# Altium project Dashboard.PrjPcb
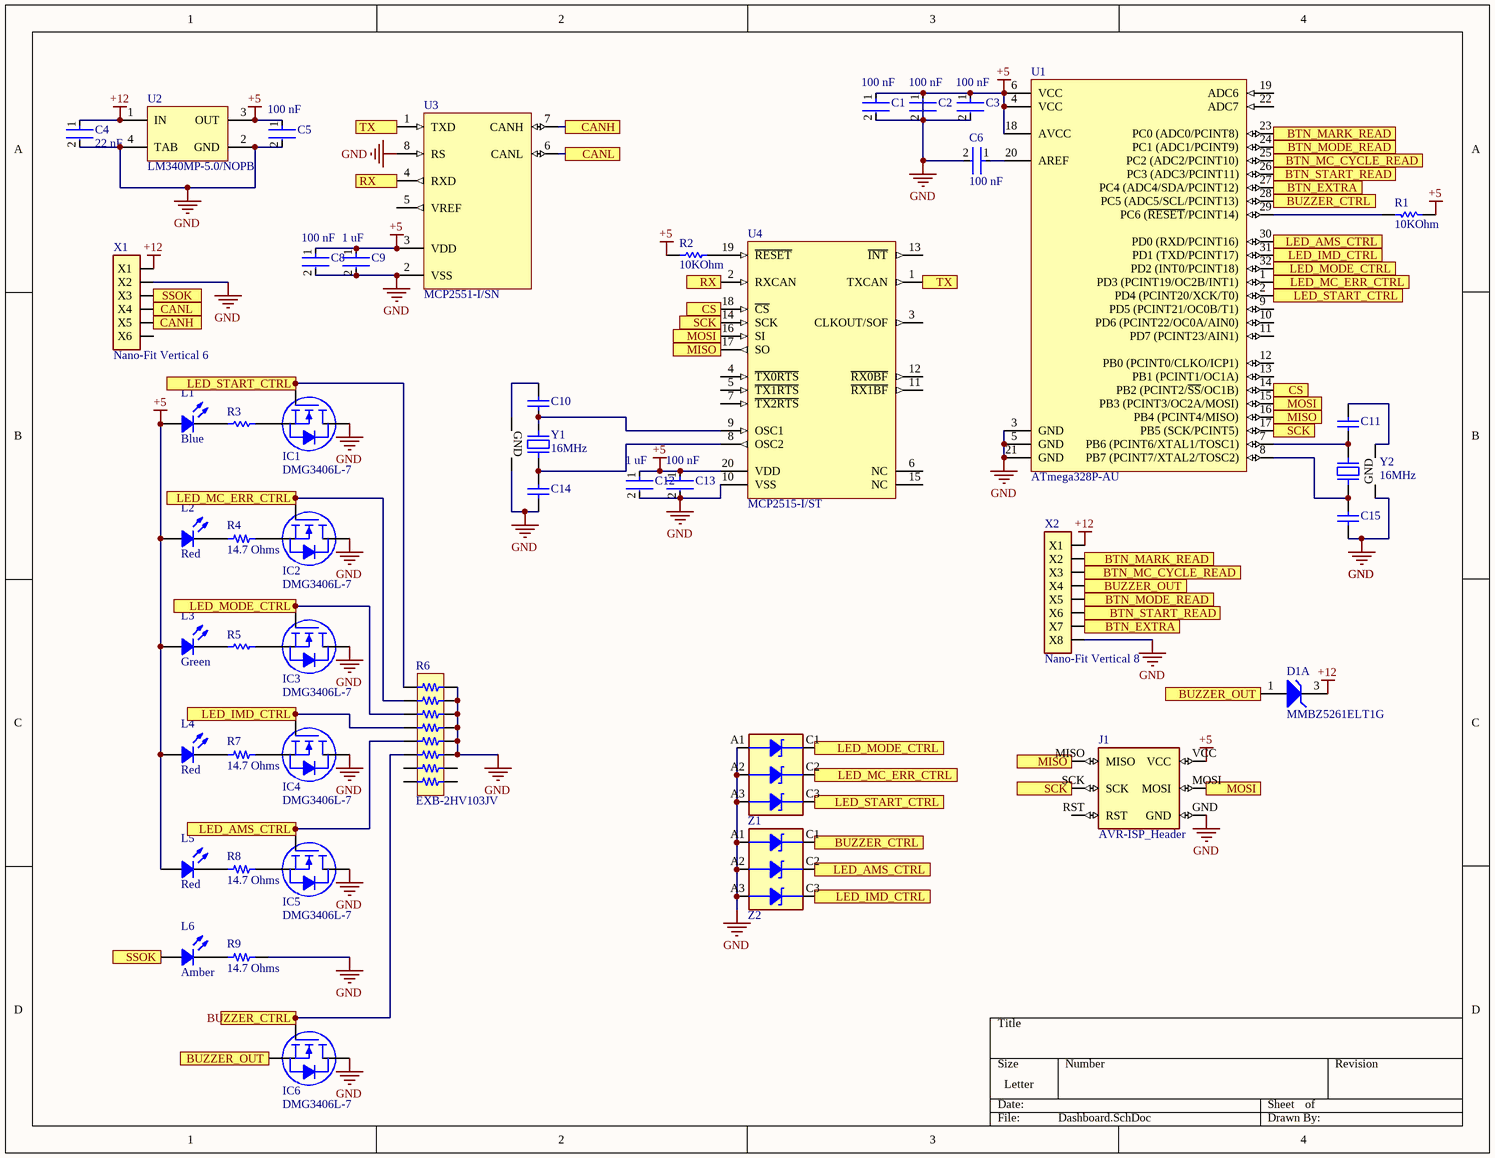
[diagram p0: Dashboard.SchDoc]
1 sheet, 47 parts. Net scope: flat (ports and power ports of the same name join across sheets).
Board file: Dashboard.PcbDoc

## Sheet Dashboard.SchDoc
size Letter

### Parts
C1  value 100 nF  [FP-CC0603-DA-MFG]  (hidden comment: CC0603KRX7R7BB104)
C2  value 100 nF  [FP-CC0603-DA-MFG]  (hidden comment: CC0603KRX7R7BB104)
C3  value 100 nF  [FP-CC0603-DA-MFG]  (hidden comment: CC0603KRX7R7BB104)
C4  Capacitance: 22 nF  [FP-CC0603-DA-MFG]  (hidden comment: CC0603KRX7R8BB223)
C5  value 100 nF  [FP-CC0603-DA-MFG]  (hidden comment: CC0603KRX7R7BB104)
C6  value 100 nF  [FP-CC0603-DA-MFG]  (hidden comment: CC0603KRX7R7BB104)
C8  value 100 nF  [FP-CC0603-DA-MFG]  (hidden comment: CC0603KRX7R7BB104)
C9  value 1 uF  [FP-CC0603-DA-MFG]  (hidden comment: CC0603KRX7R7BB105)
C10  06032U150GAT2A  [CAPC1508X91X25LL25T13]  (value not drawn)
C11  06032U150GAT2A  [CAPC1508X91X25LL25T13]  (value not drawn)
C12  value 1 uF  [FP-CC0603-DA-MFG]  (hidden comment: CC0603KRX7R7BB105)
C13  value 100 nF  [FP-CC0603-DA-MFG]  (hidden comment: CC0603KRX7R7BB104)
C14  06032U150GAT2A  [CAPC1508X91X25LL25T13]  (value not drawn)
C15  06032U150GAT2A  [CAPC1508X91X25LL25T13]  (value not drawn)
D1  MMBZ5261ELT1G  [ONSC-SOT-23-3-318-08_V]  (part A of 2)
IC1  DMG3406L-7  [DIODES SOT-23-3]
IC2  DMG3406L-7  [DIODES SOT-23-3]
IC3  DMG3406L-7  [DIODES SOT-23-3]
IC4  DMG3406L-7  [DIODES SOT-23-3]
IC5  DMG3406L-7  [DIODES SOT-23-3]
IC6  DMG3406L-7  [DIODES SOT-23-3]
J1  AVR-ISP_Header  [AVR-ISP Header]
L1  Blue  [Cree XLamp]
L2  Red  [Cree XLamp]
L3  Green  [Cree XLamp]
L4  Red  [Cree XLamp]
L5  Red  [Cree XLamp]
L6  Amber  [Cree XLamp]
R1  Resistance: 10KOhm  [RESC1608X55X25ML10T15]  (hidden comment: RC0603FR-0710KL)
R2  Resistance: 10KOhm  [RESC1608X55X25ML10T15]  (hidden comment: RC0603FR-0710KL)
R3  CRCW060310R0FKEA  [RESC1609X50X30ML10T20]  (value not drawn)
R4  14.7 Ohms  [RES 0603_1608]
R5  CRCW060310R0FKEA  [RESC1609X50X30ML10T20]  (value not drawn)
R6  EXB-2HV103JV  [RESNET 1506-16 CONVEX]
R7  14.7 Ohms  [RES 0603_1608]
R8  14.7 Ohms  [RES 0603_1608]
R9  14.7 Ohms  [RES 0603_1608]
U1  ATmega328P-AU  [32A_M]
U2  LM340MP-5.0/NOPB  [DCY0004A_L]
U3  MCP2551-I/SN  [SOIC-SN8_N]
U4  MCP2515-I/ST  [TSSOP-ST20_N]
X1  Nano-Fit Vertical 6  [Nano-Fit Vertical 6]
X2  Nano-Fit Vertical 8  [NANO-FIT VERTICAL 8]
Y1  16MHz  [NDK NX3225SA]
Y2  16MHz  [NDK NX3225SA]
Z1  MMBZ5245BTS-7-F  [SOT-363]  (value not drawn)
Z2  MMBZ5245BTS-7-F  [SOT-363]  (value not drawn)

### Ports
BTN_EXTRA, BTN_MARK_READ, BTN_MC_CYCLE_READ, BTN_MODE_READ, BTN_START_READ, BUZZER_CTRL, BUZZER_OUT, CANH, CANL, CS, LED_AMS_CTRL, LED_IMD_CTRL, LED_MC_ERR_CTRL, LED_MODE_CTRL, LED_START_CTRL, MISO, MOSI, RX, SCK, SSOK, TX

### Nets
+5: C1.1 C2.1 C3.1 C5.1 C8.1 C9.1 C12.1 C13.1 J1.VCC L1.1 L2.1 L3.1 L4.1 L5.1 R1.1 R2.1 U1.4(VCC) U1.6(VCC) U1.18(AVCC) U2.3(OUT) U3.3(VDD) U4.20(VDD)
+12: C4.1 D1.3(K) U2.1(IN) X1.1(X1) X2.1(X1)
GND: C1.2 C2.2 C3.2 C4.2 C5.2 C6.2 C8.2 C9.2 C12.2 C13.2 C14.1 C15.1 IC1.3(D) IC2.3(D) IC3.3(D) IC4.3(D) IC5.3(D) IC6.3(D) J1.GND R6.11 R6.12 R6.13 R6.14 R6.15 R6.16 R9.2 U1.3(GND) U1.5(GND) U1.21(GND) U2.2(GND) U2.4(TAB) U3.2(VSS) U3.8(RS) U4.10(VSS) X1.2(X2) X2.8(X8) Y1.2(GND) Y2.4(GND) Z1.A1 Z1.A2 Z1.A3 Z2.A1 Z2.A2 Z2.A3
NetC6_1: C6.1 U1.20(AREF)
NetC10_1: C10.1 U4.9(OSC1) Y1.1
NetC10_2: C10.2 Y1.4(GND)
NetC11_1: C11.1 Y2.2(GND)
NetC11_2: C11.2 U1.7(PB6_(PCINT6/XTAL1/TOSC1)) Y2.3
NetC14_2: C14.2 U4.8(OSC2) Y1.3
NetC15_2: C15.2 U1.8(PB7_(PCINT7/XTAL2/TOSC2)) Y2.1
NetD1_1: D1.1(A) IC6.2(S) X2.4(X4) ; port BUZZER_OUT
NetIC1_1: IC1.1(G) R6.1 U1.2(PD4_(PCINT20/XCK/T0)) Z1.C3 ; port LED_START_CTRL
NetIC1_2: IC1.2(S) R3.2
NetIC2_1: IC2.1(G) R6.2 U1.1(PD3_(PCINT19/OC2B/INT1)) Z1.C2 ; port LED_MC_ERR_CTRL
NetIC2_2: IC2.2(S) R4.2
NetIC3_1: IC3.1(G) R6.3 U1.32(PD2_(INT0/PCINT18)) Z1.C1 ; port LED_MODE_CTRL
NetIC3_2: IC3.2(S) R5.2
NetIC4_1: IC4.1(G) R6.4 U1.31(PD1_(TXD/PCINT17)) Z2.C3 ; port LED_IMD_CTRL
NetIC4_2: IC4.2(S) R7.2
NetIC5_1: IC5.1(G) R6.5 U1.30(PD0_(RXD/PCINT16)) Z2.C2 ; port LED_AMS_CTRL
NetIC5_2: IC5.2(S) R8.2
NetIC6_1: IC6.1(G) R6.6 U1.28(PC5_(ADC5/SCL/PCINT13)) Z2.C1 ; port BUZZER_CTRL
NetJ1_MISO: J1.MISO U1.16(PB4_(PCINT4/MISO)) U4.17(SO) ; port MISO
NetJ1_MOSI: J1.MOSI U1.15(PB3_(PCINT3/OC2A/MOSI)) U4.16(SI) ; port MOSI
NetJ1_SCK: J1.SCK U1.17(PB5_(SCK/PCINT5)) U4.14(SCK) ; port SCK
NetL1_2: L1.2 R3.1
NetL2_2: L2.2 R4.1
NetL3_2: L3.2 R5.1
NetL4_2: L4.2 R7.1
NetL5_2: L5.2 R8.1
NetL6_1: L6.1 X1.3(X3) ; port SSOK
NetL6_2: L6.2 R9.1
NetR1_2: R1.2 U1.29(PC6_(~{RESET}/PCINT14))
NetR2_2: R2.2 U4.19(~{RESET})
NetU1_14: U1.14(PB2_(PCINT2/~{SS}/OC1B)) U4.18(~{CS}) ; port CS
NetU1_23: U1.23(PC0_(ADC0/PCINT8)) X2.2(X2) ; port BTN_MARK_READ
NetU1_24: U1.24(PC1_(ADC1/PCINT9)) X2.5(X5) ; port BTN_MODE_READ
NetU1_25: U1.25(PC2_(ADC2/PCINT10)) X2.3(X3) ; port BTN_MC_CYCLE_READ
NetU1_26: U1.26(PC3_(ADC3/PCINT11)) X2.6(X6) ; port BTN_START_READ
NetU1_27: U1.27(PC4_(ADC4/SDA/PCINT12)) X2.7(X7) ; port BTN_EXTRA
NetU3_1: U3.1(TXD) U4.1(TXCAN) ; port TX
NetU3_4: U3.4(RXD) U4.2(RXCAN) ; port RX
NetU3_6: U3.6(CANL) X1.4(X4) ; port CANL
NetU3_7: U3.7(CANH) X1.5(X5) ; port CANH

Not connected (* = marked no-connect by the designer): J1 RST; R6 7 8 9 10; U1 9(PD5_(PCINT21/OC0B/T1)) 10(PD6_(PCINT22/OC0A/AIN0)) 11(PD7_(PCINT23/AIN1)) 12(PB0_(PCINT0/CLKO/ICP1)) 13(PB1_(PCINT1/OC1A)) 19(ADC6) 22(ADC7); U3 5(VREF); U4 3(CLKOUT/SOF) 4(~{TX0RTS}) 5(~{TX1RTS}) 6(NC) 7(~{TX2RTS}) 11(~{RX1BF}) 12(~{RX0BF}) 13(~{INT}) 15(NC); X1 6(X6)

### Library data of the parts
C1-C3 C5 C6 C8 C13 = CMP-03422-000030-1: CAP CER 0.1UF 16V X7R 0603; Manufacturer: YAGEO; Tolerance: 0.1; Temperature Coefficient: 15%; Material: Ceramic; Voltage Rating: 16 V; Package: CC0603-DA; ComponentLink2Description: Datasheet; Octopart: https://octopart.com/cc0603krx7r7bb104-yageo-192941; Temperature Range High: +125°C; Digikey Description: CAP CER 0.1UF 16V X7R 0603; Voltage: 16 V; Device Class L2: Capacitors; Height: 0.9mm; Temperature: -55°C to +125°C; Manufacturer Part Number: CC0603KRX7R7BB104; Device Class L1: Passive Components; Device Class L3: Ceramic Capacitors; ComponentLink2URL: http://www.yageo.com/documents/recent/UPY-GPHC_X7R_6.3V-to-50V_18.pdf; Footprint Url: http://www.yageo.com/exep/pages/download/literatures/UPY-C_GEN_24.pdf; RoHS: TRUE; Temperature Range Low: -55°C; Temperature Characteristic: X7R; Lead Free: Yes; Capacitance: 100 nF; Category: Cap; Mouser Description: Multilayer Ceramic Capacitor, CC Series, 0.1 - F, - 10%, X7R, 16 V, 0603 [1608 Metric]; Automotive: No
C4 = CMP-03422-001178-1: CAP CER 0.022UF 25V X7R 0603; Manufacturer: YAGEO; Material: Ceramic; Temperature Coefficient: 15%; Value: 22 nF; Tolerance: 0.1; Temperature Range High: +125°C; Temperature: -55°C to +125°C; Mouser Description: Multilayer Ceramic Capacitors MLCC - SMD/SMT 22nF 25V X7R 10%; Voltage: 25 V; Height: 0.9mm; Temperature Characteristic: X7R; ComponentLink2Description: Datasheet; Digikey Description: CAP CER 0.022UF 25V X7R 0603; Category: Cap; Temperature Range Low: -55°C; Lead Free: Yes; RoHS: TRUE; Voltage Rating: 25 V; Package: CC0603-DA; Footprint Url: http://www.yageo.com/exep/pages/download/literatures/UPY-C_GEN_24.pdf; Device Class L1: Passive Components; Device Class L2: Capacitors; Octopart: https://octopart.com/cc0603krx7r8bb223-yageo-39467728; Manufacturer Part Number: CC0603KRX7R8BB223; Device Class L3: Ceramic Capacitors; Automotive: No; ComponentLink2URL: http://www.yageo.com/documents/recent/UPY-GPHC_X7R_6.3V-to-50V_18.pdf
C9 C12 = CMP-03422-000924-1: CAP CER 1UF 16V X7R 0603; Manufacturer: YAGEO; Tolerance: 0.1; Temperature Coefficient: 15%; Material: Ceramic; Package: CC0603-DA; RoHS: TRUE; Device Class L2: Capacitors; Temperature Characteristic: X7R; Temperature: -55°C to +125°C; Temperature Range Low: -55°C; Automotive: No; ComponentLink2Description: Datasheet; Lead Free: Yes; Capacitance: 1 uF; ComponentLink2URL: http://www.yageo.com/documents/recent/UPY-GPHC_X7R_6.3V-to-50V_18.pdf; Device Class L1: Passive Components; Voltage: 16 V; Octopart: https://octopart.com/cc0603krx7r7bb105-yageo-42271928; Category: Cap; Digikey Description: CAP CER 1UF 16V X7R 0603; Footprint Url: http://www.yageo.com/exep/pages/download/literatures/UPY-C_GEN_24.pdf; Height: 0.9mm; Manufacturer Part Number: CC0603KRX7R7BB105; Voltage Rating: 16 V; Temperature Range High: +125°C; Mouser Description: Multilayer Ceramic Capacitor, CC Series, 1 - F, - 10%, X7R, 16 V, 0603 [1608 Metric]; Device Class L3: Ceramic Capacitors
C10 C11 C14 C15 = CMP-2006-04659-1: Manufacturer: AVX Interconnect / Elco; Part Number: 06032U150GAT2A
D1 = CMP-1060-01202-1: Zener Voltage Regulator, 225 mW, 3-Pin SOT-23, Pb-Free, Tape and Reel; Manufacturer: On Semiconductor; VZ Typ (V): 47; ComponentLink3URL: http://www.onsemi.cn/pub_link/Collateral/318-08.PDF; ComponentLink3Description: Package Specification; ComponentLink1Description: Manufacturer URL; PackageReference: SOT-23-3-318-08; ComponentLink2Description: Datasheet; ComponentLink1URL: http://www.onsemi.com/; PackageDescription: 3-Pin Small Outline Transistor, Body 2.92 x 1.3 mm, Pitch 0.95 mm; Packing: Tape and Reel; RoHS: Pb-Free; PackageVersion: Rev. AP, 11/2009; ComponentLink2URL: http://www.onsemi.cn/pub_link/Collateral/MMBZ5221ELT1-D.PDF; DatasheetVersion: Rev. 7; PartNumber: MMBZ5261ELT1G; Mounting Technology: Surface Mount
IC1-IC6 = DMG3406L-7: MOSFET N-CH 30V 3.6A SOT23; Manufacturer: Diodes Incorporated; Current - Continuous Drain (Id) @ 25°C: 3.6A (Ta); Drive Voltage (Max Rds On,  Min Rds On): 4.5V, 10V; FET Type: N-Channel; Gate Charge (Qg) (Max) @ Vgs: 11.2nC @ 10V; Input Capacitance (Ciss) (Max) @ Vds: 495pF @ 15V; Power Dissipation (Max): 770mW (Ta); Rds On (Max) @ Id, Vgs: 50mOhm @ 3.6A, 10V; Vgs (Max): ±20V; Vgs(th) (Max) @ Id: 2V @ 250µA; Part Number: DMG3406L-7; ComponentLink1Description: Datasheet; ComponentLink1URL: https://www.diodes.com/assets/Datasheets/DMG3406L.pdf; ComponentLink2Description: DigiKey Link; ComponentLink2URL: http://digikey.com/product-detail/en/diodes-incorporated/DMG3406L-7/DMG3406L-7DICT-ND/5223238; Device Package: TO-236-3, SC-59, SOT-23-3; Drain to Source Voltage (Vdss): 30V; LastUpdated: 1/21/2020 4:00:19 AM; Lifecycle Status: Active; Minimum Order: 1; Mounting Type: Surface Mount; Operating Temperature: -55°C ~ 150°C (TJ); Package / Case: TO-236-3, SC-59, SOT-23-3; Packaging: TapeAndReel; Part Status: Active; Price: 0.08; Series: -; Supplier 1: DigiKey; Supplier Part Number 1: DMG3406L-7DICT-ND; Supplier Device Package: SOT-23; Technology: MOSFET (Metal Oxide)
L1 = LED - Blue Xlamp: Blue LED Cree XLamp XP-E2 / XPEBBL-L1-0000-00Y01; pin to pad: 1>V+ 2>V-; Supplier 1: Digi-Key; Supplier 2: Digi-Key; Supplier 3: Mouser; Supplier 4: Avnet; Supplier 5: Digi-Key; Supplier 6: RSComponents; Supplier 7: RSComponents; Supplier 8: RSComponents; Supplier 9: Arrow; Supplier 10: Digi-Key; Supplier Part Number 9: XPEBBL-L1-0000-00Y01; Supplier Part Number 8: 1629932; Supplier Part Number 10: XPEBBL-L1-0000-00Y01-ND; Supplier Part Number 7: 9076677P; Supplier Part Number 6: 9076677; Supplier Part Number 4: XPEBBL-L1-0000-00Y01; Supplier Part Number 3: 941-XPEBBLL10000Y01; Supplier Part Number 5: XPEBBL-L1-0000-00Y01TR-ND; Supplier Part Number 2: XPEBBL-L1-0000-00Y01DKR-ND; Supplier Part Number 1: XPEBBL-L1-0000-00Y01CT-ND
L2 L4 L5 = LED - Red XLlamp: Red LED Cree XLamp XP-E2 / XPEBRD-L1-R250-00502; pin to pad: 1>V+ 2>V-; Supplier 1: Mouser; Supplier 2: Avnet; Supplier 3: Digi-Key; Supplier 4: Arrow; Supplier Part Number 2: XPEBRD-L1-R250-00502; Supplier Part Number 1: 941-XPEBRDL1R250502; Supplier Part Number 3: XPEBRD-L1-R250-00502-ND; Supplier Part Number 4: XPEBRD-L1-R250-00502
L3 = LED - Green Xlamp: Green LED Cree XLamp XP-E2 / XPEBGR-L1-0000-00A01; pin to pad: 1>V+ 2>V-; Supplier 1: Digi-Key; Supplier 2: Digi-Key; Supplier 3: Digi-Key; Supplier 4: Arrow; Supplier 5: Newark; Supplier 6: Mouser; Supplier 7: Newark; Supplier 8: Avnet; Supplier 9: Farnell; Supplier 10: Farnell; Supplier 11: Digi-Key; Supplier Part Number 11: XPEBGR-L1-0000-00A01-ND; Supplier Part Number 10: 2839922RL; Supplier Part Number 9: 2839922; Supplier Part Number 7: 95W0598; Supplier Part Number 3: XPEBGR-L1-0000-00A01TR-ND; Supplier Part Number 6: 941-XPEBGRL10000A01; Supplier Part Number 8: XPEBGR-L1-0000-00A01; Supplier Part Number 5: 49AC0942; Supplier Part Number 4: XPEBGR-L1-0000-00A01; Supplier Part Number 2: XPEBGR-L1-0000-00A01DKR-ND; Supplier Part Number 1: XPEBGR-L1-0000-00A01CT-ND
L6 = LED - Amber Xlamp: Amber LED Cree XLamp XP-E2 / XPEBAM-L1-0000-00601; pin to pad: 1>V+ 2>V-; Supplier 1: Digi-Key; Supplier 2: Digi-Key; Supplier 3: Arrow; Supplier 4: Newark; Supplier 5: Newark; Supplier 6: Avnet; Supplier 7: Mouser; Supplier 8: Digi-Key; Supplier 9: Farnell; Supplier 10: Farnell; Supplier 11: Digi-Key; Supplier Part Number 1: XPEBAM-L1-0000-00601CT-ND; Supplier Part Number 2: XPEBAM-L1-0000-00601DKR-ND; Supplier Part Number 4: 49AC0940; Supplier Part Number 3: XPEBAM-L1-0000-00601; Supplier Part Number 5: 95W0551; Supplier Part Number 6: XPEBAM-L1-0000-00601; Supplier Part Number 7: 941-XPEBAML10000601; Supplier Part Number 8: XPEBAM-L1-0000-00601TR-ND; Supplier Part Number 9: 2839920; Supplier Part Number 10: 2839920RL; Supplier Part Number 11: XPEBAM-L1-0000-00601-ND
R1 R2 = CMP-2100-03664-1: Chip Resistor, 10 KOhm, +/- 1%, 01 W, -55 to 155 degC, 0603 (1608 Metric), RoHS, Tape and Reel; Manufacturer: Yageo; Temperature Coefficient: 100ppm/degreesC; Voltage Rating: 75V; Power Rating: 100mW; Voltage Rating (DC): 50V; Composition: ThickFilm; RoHSCompliant: true; Height: 0.45mm; Lead Free: LeadFree; Case Code (Metric): 1608; Case/Package: 0603; Datasheet Version: Rev. 5, 10/2016; Package Reference: 0603; Depth: 0.8mm; Package Description: 2-Pin Surface Mount Device, Body 1.6 x 0.8 mm; Case Code (Imperial): 0603; Packaging: TapeandReel; Termination: SMD/SMT; Lead Pitch: 0.3mm; Width: 0.8mm; Number of Pins: 2; Length: 1.6mm; REACH SVHC: NoSVHC; Military Standard: Not; Max Operating Temperature: 155degC; Min Operating Temperature: -55degC; Manufacturer URL: http://www.yageo.com/; Datasheet URL: http://www.yageo.com/NewPortal/yageodocoutput?fileName=/pdf/R-Chip/PYu-RC_Group_51_RoHS_L_5.pdf; Weight: 7.1E-05oz; Tolerance: 1%
R3 R5 = CMP-2000-03845-1: Manufacturer: Vishay Dale; Part Number: CRCW060310R0FKEA
R4 R7-R9 = ERJ-3EKF14R7V: RES SMD 14.7 OHM 1% 1/10W 0603; Manufacturer: Panasonic Electronic Components; Power (Watts): 0.1W, 1/10W; Temperature Coefficient: ±100ppm/°C; Part Number: ERJ-3EKF14R7V; Value: 14.7 Ohms; ComponentLink1Description: Datasheet; ComponentLink1URL: https://industrial.panasonic.com/cdbs/www-data/pdf/RDA0000/AOA0000C304.pdf; ComponentLink2Description: DigiKey Link; ComponentLink2URL: http://digikey.com/product-detail/en/panasonic-electronic-components/ERJ-3EKF14R7V/P14.7HCT-ND/198163; Composition: Thick Film; Device Package: 0603 (1608 Metric); Features: Automotive AEC-Q200; Height - Seated (Max): 0.022" (0.55mm); LastUpdated: 1/21/2020 12:14:34 AM; Lifecycle Status: Active; Minimum Order: 1; Number of Terminations: 2; Operating Temperature: -55°C ~ 155°C; Package / Case: 0603 (1608 Metric); Packaging: TapeAndReel; PartId: 26262; Part Status: Active; Price: 0.01; Ratings: AEC-Q200; Resistance: 14.7 Ohms; Series: ERJ; Size / Dimension: 0.063" L x 0.031" W (1.60mm x 0.80mm); Supplier 1: DigiKey; Supplier Part Number 1: P14.7HCT-ND; Supplier Device Package: 0603; Tolerance: ±1%
R6 = EXB-2HV103JV: RES ARRAY 8 RES 10K OHM 1506; Manufacturer: Panasonic Electronic Components; Circuit Type: Isolated; Number of Resistors: 8; Power Per Element: 62.5mW; Temperature Coefficient: ±200ppm/°C; Tolerance: ±5%; Part Number: EXB-2HV103JV; Applications: Automotive AEC-Q200; ComponentLink1Description: Datasheet; ComponentLink1URL: https://industrial.panasonic.com/cdbs/www-data/pdf/AOC0000/AOC0000C14.pdf; ComponentLink2Description: DigiKey Link; ComponentLink2URL: http://digikey.com/product-detail/en/panasonic-electronic-components/EXB-2HV103JV/Y1103CT-ND/285393; Device Package: 1506, Convex, Long Side Terminals; Height - Seated (Max): 0.022" (0.55mm); LastUpdated: 1/21/2020 3:39:13 AM; Lifecycle Status: Active; Minimum Order: 1; Mounting Type: Surface Mount; Number of Pins: 16; Operating Temperature: -55°C ~ 125°C; Package / Case: 1506, Convex, Long Side Terminals; Packaging: TapeAndReel; PartId: 657; Part Status: Active; Price: 0.03; Resistance (Ohms): 10k; Series: EXB; Size / Dimension: 0.150" L x 0.063" W (3.80mm x 1.60mm); Supplier 1: DigiKey; Supplier Part Number 1: Y1103CT-ND; Supplier Device Package: 1506
U1 = CMP-0095-00269-2: 8-bit AVR Microcontroller, 32KB Flash, 1KB EEPROM, 2KB SRAM, 32-pin TQFP, Industrial Grade (-40°C to 85°C); PackageDescription: 32-Lead, 7x7x1.0 mm Body, 0.8mm Lead Pitch, Thin Profile Plastic Quad Flat Package (TQFP); DatasheetVersion: revD, May-2011; RevisionNote: DatasheetVersion & PackageVersion updated. URLs added.; ComponentLink1URL: http://www.atmel.com/; ComponentLink2Description: ATmega48A/48PA/88A/88PA/168A/168PA/328/328P Datasheet; Code_JEDEC: MS-026-ABA; ComponentLink1Description: Manufacturer URL; PackageReference: 32A; ComponentLink3Description: ATmega48A/48PA/88A/88PA/168A/168PA/328/328P Summary; ComponentLink2URL: http://www.atmel.com/dyn/resources/prod_documents/doc8271.pdf; PackageVersion: revC, Oct-2010; ComponentLink3URL: http://www.atmel.com/dyn/resources/prod_documents/8271S.pdf
U2 = CMP-0062-01784-3: Series 3-Terminal Positive Regulators, 4-pin SOT-223, Pb-Free; Manufacturer: Texas Instruments; PowerWise: N; CompType: LDO IC; PackageTopMarking: XYTT*N00A; Code_IPC: SOT223-4; PackageReference: DCY0004A; ComponentLink1Description: Datasheet URL; PackageDescription: Molded SOT-223, 6.50 x 3.56 x 1.6mm Body, 4 Lead, 2.3mm Pitch; PinCount: 4; RoHS: Y; ComponentLink1URL: http://www.ti.com/general/docs/lit/getliterature.tsp?genericPartNumber=LM340-N&fileType=pdf; Code_JEDEC: TO-261-AA
U3 = CMP-0186-00138-2: High-Speed CAN Transceiver, 8-Pin SOIC, Industrial Temperature; Code_JEDEC: MS-012; ComponentLink3URL: http://www.microchip.com/stellent/groups/techpub_sg/documents/packagingspec/en012702.pdf; DatasheetVersion: revF, Jul-2010; PackageVersion: revBB, Aug-2009; PackageDescription: 8-Lead Plastic Small Outline (SN) - Narrow, 3.90mm Body [SOIC]; ComponentLink1URL: http://www.microchip.com/; ComponentLink3Description: Package Specification; ComponentLink2Description: Datasheet; Code_IPC: SOIC127P600-8; ComponentLink1Description: Manufacturer URL; PackageReference: SOIC-SN8; ComponentLink2URL: http://ww1.microchip.com/downloads/en/DeviceDoc/21667F.pdf; RevisionNote: URLs added. DatasheetVersion updated.
U4 = CMP-0186-00077-2: Stand-Alone CAN Controller With SPI Interface, 20-Pin TSSOP, Industrial Temperature; DatasheetVersion: revF, Oct-2010; ComponentLink1Description: Manufacturer URL; PackageDescription: 20-Lead Plastic Thin Shrink Small Outline (ST) - 4.4mm Body [TSSOP]; ComponentLink1URL: http://www.microchip.com/; RevisionNote: URLs added. DatasheetVersion updated.; PackageReference: TSSOP-ST20; Code_JEDEC: MO-153-AC; ComponentLink2Description: Datasheet; ComponentLink2URL: http://ww1.microchip.com/downloads/en/DeviceDoc/21801f.pdf; PackageVersion: revBB, Aug-2009; ComponentLink3URL: http://www.microchip.com/stellent/groups/techpub_sg/documents/packagingspec/en012702.pdf; ComponentLink3Description: Package Specification
Y1 Y2 = NX3225SA-16.000000MHZ-T1: CRYSTAL 16.0000MHZ 10PF SMD; Manufacturer: NDK America, Inc.; ESR (Equivalent Series Resistance): 60 Ohms; Frequency Stability: ±10ppm; Operating Mode: Fundamental; Part Number: NX3225SA-16.000000MHZ-T1; ComponentLink1Description: Datasheet; ComponentLink1URL: //media.digikey.com/pdf/Data Sheets/NDK PDFs/NX3225SA-16.000000MHz-T1.pdf; ComponentLink2Description: DigiKey Link; ComponentLink2URL: http://digikey.com/product-detail/en/ndk-america-inc/NX3225SA-16.000000MHZ-T1/644-1100-1-ND/1468361; Device Package: 4-SMD, No Lead; Frequency: 16MHz; Frequency Tolerance: ±10ppm; Height - Seated (Max): 0.028" (0.70mm); LastUpdated: 1/21/2020 3:23:16 AM; Lifecycle Status: Active; Load Capacitance: 10pF; Minimum Order: 1; Mounting Type: Surface Mount; Operating Temperature: -20°C ~ 70°C; Package / Case: 4-SMD, No Lead; Packaging: TapeAndReel; PartId: 592; Part Status: Active; Price: 0.47; Series: NX3225SA; Size / Dimension: 0.126" L x 0.098" W (3.20mm x 2.50mm); Supplier 1: DigiKey; Supplier Part Number 1: 644-1100-1-ND; Type: MHz Crystal; Value: 16MHz
Z1 Z2 = MMBZ5245BTS-7-F: Three independent zener diodes in an array; pin to pad: A1>1 A2>2 A3>3 C1>6 C2>5 C3>4; ComponentLink1Description: New link; ComponentLink1URL: *; Supplier 1: Digi-Key; Supplier 2: Digi-Key; Supplier 3: Digi-Key; Supplier 4: Mouser; Supplier 5: Avnet; Supplier 6: Arrow; Supplier 7: Digi-Key; Supplier Part Number 1: MMBZ5245BTS-7-FDICT-ND; Supplier Part Number 2: MMBZ5245BTS-7-FDIDKR-ND; Supplier Part Number 3: MMBZ5245BTS-7-FDITR-ND; Supplier Part Number 4: 621-MMBZ5245BTS-7-F; Supplier Part Number 6: MMBZ5245BTS-7-F; Supplier Part Number 5: MMBZ5245BTS-7-F; Supplier Part Number 7: MMBZ5245BTS-7-F-ND